# EAGLE design Adafruit 6-ISP AVR (EAGLE 6.4)
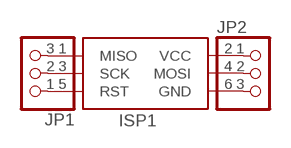
[diagram p0: schematic, sheet 1]

## Parts
ISP1  AVRISP-BOX  [AVRISP-BOX]
JP1  PINHD-1X3CB  [1X03-CLEANBIG]
JP2  PINHD-1X3CB  [1X03-CLEANBIG]

## Nets
GND: ISP1.6(GND) JP2.3
MISO: ISP1.1(MISO) JP1.3
MOSI: ISP1.4(MOSI) JP2.2
RST: ISP1.5(RST) JP1.1
SCK: ISP1.3(SCK) JP1.2
VCC: ISP1.2(VCC) JP2.1

## Library data of the parts
ISP1 = adafruit:AVRISP: AVR ISP HEADER Standard 6 pin header for AVR programming
JP1 JP2 = adafruit:PINHD-1X3: PIN HEADER

## Board
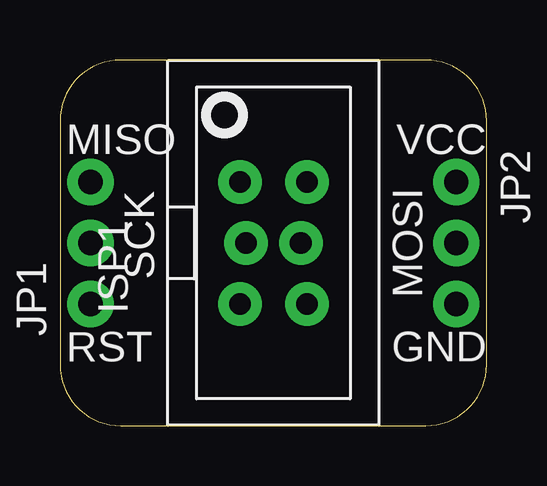
[diagram p1: board, top side]
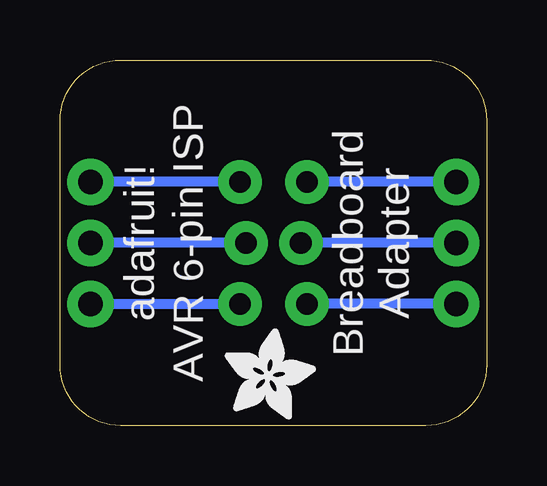
[diagram p2: board, bottom side, seen from below]

Size 17.78 x 15.24 mm. Coordinates in mm from the lower left corner, seen from the top.
Outline: 0,12.7 0,2.54 arc90 2.54,0 15.24,0 arc90 17.78,2.54 17.78,12.7 arc90 15.24,15.24 2.54,15.24 arc90 0,12.7
Copper layers (1*16): Top 0.035mm / dielectric 1.5mm / Bottom 0.035mm
Design rules "adafruit *": minimum track width 8mil, minimum drill 15.5mil, track to track 8mil, track to pad 8mil, pad to pad 8mil, via to via 8mil, smd to smd 8mil, copper to edge 10mil, drill to drill 8mil, minimum pad ring 18mil, minimum via ring 8mil, stop-mask expansion 4mil, vias tented up to drill 20mil, thermal gap 10mil

### Footprints (pad centres in the part's own frame; a part is rotated, then mirrored left to right if it is on the bottom)
AVRISP-BOX = drill 0.9 pad 1.626: 1 -1.397,2.54; 2 1.397,2.54; 3 -1.143,0; 4 1.143,0; 5 -1.397,-2.54; 6 1.397,-2.54
1X03-CLEANBIG = drill 1.016 pad 1.676: 1 -2.54,0; 2 0,0; 3 2.54,0

### Placement (x,y rotation side)
ISP1  8.89,7.62 0 top
JP1  1.27,7.62 90 top
JP2  16.51,7.62 270 top
U$1  [ADAFRUIT_3.5MM]  10.92,0.25 0 bottom

### Tracks (layer width: path | path; a pad name or v marks a point on that pad's centre or on a via)
GND
  Bottom 0.406: JP2.3 ISP1.6
MISO
  Bottom 0.406: JP1.3 ISP1.1
MOSI
  Bottom 0.406: ISP1.4 JP2.2
RST
  Bottom 0.406: JP1.1 ISP1.5
SCK
  Bottom 0.406: JP1.2 ISP1.3
VCC
  Bottom 0.406: ISP1.2 JP2.1

### Text on the board
tPlace: MISO | VCC | SCK | MOSI | RST | GND
bPlace: Breadboard / Adapter | AVR 6-pin ISP | adafruit!